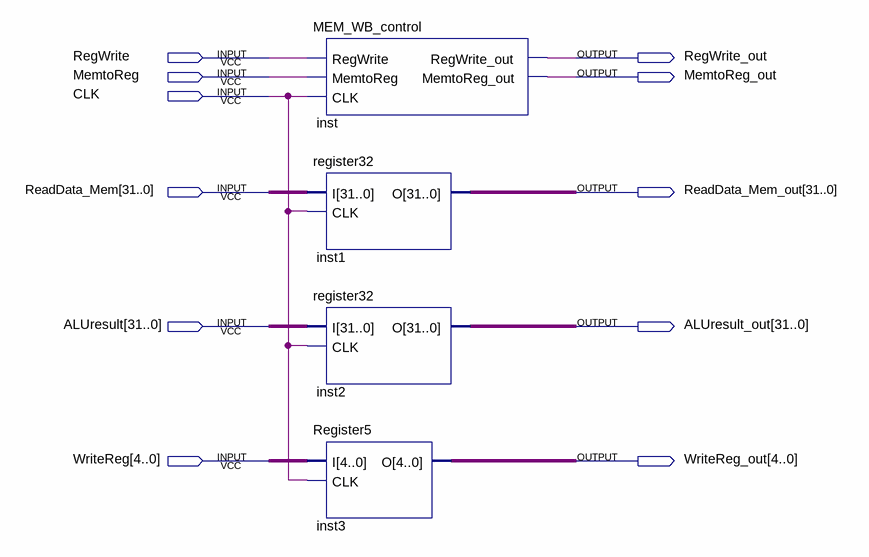
[diagram p0: schematic sheet]
// Quartus schematic MEM_WB.bdf as structural Verilog: 4 symbols, 11 pins
module MEM_WB (
  input  RegWrite,
  input  MemtoReg,
  input  CLK,
  input  [31:0] ReadData_Mem,
  input  [31:0] ALUresult,
  input  [4:0] WriteReg,
  output RegWrite_out,
  output MemtoReg_out,
  output [31:0] ReadData_Mem_out,
  output [31:0] ALUresult_out,
  output [4:0] WriteReg_out
);

  MEM_WB_control inst (
    .RegWrite(RegWrite), .MemtoReg(MemtoReg), .CLK(CLK), .RegWrite_out(RegWrite_out),
    .MemtoReg_out(MemtoReg_out));
  register32 inst1 (.I(ReadData_Mem), .CLK(CLK), .O(ReadData_Mem_out));
  register32 inst2 (.I(ALUresult), .CLK(CLK), .O(ALUresult_out));
  Register5 inst3 (.I(WriteReg), .CLK(CLK), .O(WriteReg_out));
endmodule
